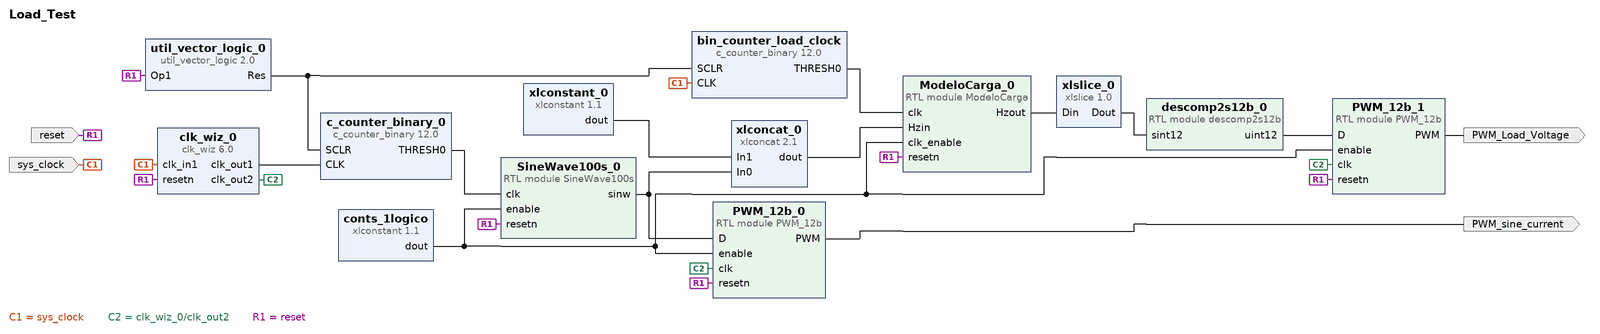
[diagram p0: block diagram of the top level]
# Vivado block design Load_Test, xc7a35ticsg324-1L, Vivado 2018.2
create_bd_design Load_Test

create_bd_port -dir I -type clk sys_clock
set_property -dict {CONFIG.FREQ_HZ 100000000 CONFIG.PHASE 0.000} [get_bd_ports sys_clock]
create_bd_port -dir O PWM_sine_current
create_bd_port -dir O PWM_Load_Voltage
create_bd_port -dir I -type rst reset
set_property -dict {CONFIG.POLARITY ACTIVE_LOW} [get_bd_ports reset]

create_bd_cell -type ip -vlnv xilinx.com:ip:clk_wiz:6.0 clk_wiz_0
set_property -dict [list \
  CONFIG.PRIMITIVE PLL \
  CONFIG.CLKOUT2_USED true \
  CONFIG.NUM_OUT_CLKS 2 \
  CONFIG.CLKOUT1_REQUESTED_OUT_FREQ 12 \
  CONFIG.CLKOUT2_REQUESTED_OUT_FREQ 430 \
  CONFIG.CLKOUT1_DRIVES BUFGCE \
  CONFIG.CLKOUT2_DRIVES BUFGCE \
  CONFIG.CLKOUT3_DRIVES BUFGCE \
  CONFIG.CLKOUT4_DRIVES BUFGCE \
  CONFIG.CLKOUT5_DRIVES BUFGCE \
  CONFIG.CLKOUT6_DRIVES BUFGCE \
  CONFIG.CLKOUT7_DRIVES BUFGCE \
  CONFIG.FEEDBACK_SOURCE FDBK_AUTO \
  CONFIG.USE_LOCKED true \
  CONFIG.RESET_PORT resetn \
  CONFIG.MMCM_DIVCLK_DIVIDE 1 \
  CONFIG.MMCM_CLKFBOUT_MULT_F 13 \
  CONFIG.MMCM_COMPENSATION ZHOLD \
  CONFIG.MMCM_CLKOUT0_DIVIDE_F 108 \
  CONFIG.MMCM_CLKOUT1_DIVIDE 3 \
  CONFIG.RESET_TYPE ACTIVE_LOW \
  CONFIG.USE_SAFE_CLOCK_STARTUP true \
  CONFIG.USE_BOARD_FLOW true \
  CONFIG.CLK_IN1_BOARD_INTERFACE sys_clock \
  CONFIG.RESET_BOARD_INTERFACE reset \
  CONFIG.CLKOUT1_JITTER 172.617 \
  CONFIG.CLKOUT1_PHASE_ERROR 82.897 \
  CONFIG.CLKOUT2_JITTER 84.092 \
  CONFIG.CLKOUT2_PHASE_ERROR 82.897 \
] [get_bd_cells clk_wiz_0]
create_bd_cell -type ip -vlnv xilinx.com:ip:c_counter_binary:12.0 c_counter_binary_0
set_property -dict [list \
  CONFIG.Output_Width 11 \
  CONFIG.Increment_Value 1 \
  CONFIG.Restrict_Count true \
  CONFIG.Final_Count_Value 7D0 \
  CONFIG.Sync_Threshold_Output true \
  CONFIG.Threshold_Value 7D0 \
  CONFIG.SCLR true \
] [get_bd_cells c_counter_binary_0]
create_bd_cell -type ip -vlnv xilinx.com:ip:xlconcat:2.1 xlconcat_0
set_property -dict {CONFIG.IN0_WIDTH 12 CONFIG.IN1_WIDTH 4} [get_bd_cells xlconcat_0]
create_bd_cell -type ip -vlnv xilinx.com:ip:xlconstant:1.1 xlconstant_0
set_property -dict {CONFIG.CONST_WIDTH 4 CONFIG.CONST_VAL 0} [get_bd_cells xlconstant_0]
create_bd_cell -type module -reference descomp2s12b descomp2s12b_0
create_bd_cell -type ip -vlnv xilinx.com:ip:xlslice:1.0 xlslice_0
set_property -dict {CONFIG.DIN_TO 0 CONFIG.DIN_FROM 11 CONFIG.DIN_WIDTH 16 CONFIG.DOUT_WIDTH 12} [get_bd_cells xlslice_0]
create_bd_cell -type ip -vlnv xilinx.com:ip:xlconstant:1.1 conts_1logico
create_bd_cell -type ip -vlnv xilinx.com:ip:c_counter_binary:12.0 bin_counter_load_clock
set_property -dict [list \
  CONFIG.Output_Width 14 \
  CONFIG.Increment_Value 1 \
  CONFIG.Restrict_Count true \
  CONFIG.Final_Count_Value 2710 \
  CONFIG.Sync_Threshold_Output true \
  CONFIG.Threshold_Value 2710 \
  CONFIG.SCLR true \
] [get_bd_cells bin_counter_load_clock]
create_bd_cell -type module -reference ModeloCarga ModeloCarga_0
create_bd_cell -type ip -vlnv xilinx.com:ip:util_vector_logic:2.0 util_vector_logic_0
set_property -dict {CONFIG.C_SIZE 1 CONFIG.C_OPERATION not} [get_bd_cells util_vector_logic_0]
create_bd_cell -type module -reference PWM_12b PWM_12b_0
create_bd_cell -type module -reference PWM_12b PWM_12b_1
create_bd_cell -type module -reference SineWave100s SineWave100s_0

# ---- connections ----

connect_bd_net [get_bd_ports sys_clock] [get_bd_pins clk_wiz_0/clk_in1] [get_bd_pins bin_counter_load_clock/CLK]
connect_bd_net [get_bd_pins clk_wiz_0/clk_out1] [get_bd_pins c_counter_binary_0/CLK]
connect_bd_net [get_bd_pins c_counter_binary_0/THRESH0] [get_bd_pins SineWave100s_0/clk]
connect_bd_net [get_bd_pins SineWave100s_0/sinw] [get_bd_pins PWM_12b_0/D] [get_bd_pins xlconcat_0/In0]
connect_bd_net [get_bd_pins xlconstant_0/dout] [get_bd_pins xlconcat_0/In1]
connect_bd_net [get_bd_pins descomp2s12b_0/uint12] [get_bd_pins PWM_12b_1/D]
connect_bd_net [get_bd_pins xlslice_0/Dout] [get_bd_pins descomp2s12b_0/sint12]
connect_bd_net [get_bd_pins clk_wiz_0/clk_out2] [get_bd_pins PWM_12b_0/clk] [get_bd_pins PWM_12b_1/clk]
connect_bd_net -net xlconstant_1_dout [get_bd_pins conts_1logico/dout] \
  [get_bd_pins ModeloCarga_0/clk_enable] [get_bd_pins PWM_12b_0/enable] [get_bd_pins PWM_12b_1/enable] \
  [get_bd_pins SineWave100s_0/enable]
connect_bd_net [get_bd_pins PWM_12b_0/PWM] [get_bd_ports PWM_sine_current]
connect_bd_net [get_bd_pins PWM_12b_1/PWM] [get_bd_ports PWM_Load_Voltage]
connect_bd_net [get_bd_pins bin_counter_load_clock/THRESH0] [get_bd_pins ModeloCarga_0/clk]
connect_bd_net [get_bd_pins ModeloCarga_0/Hzout] [get_bd_pins xlslice_0/Din]
connect_bd_net [get_bd_pins xlconcat_0/dout] [get_bd_pins ModeloCarga_0/Hzin]
connect_bd_net [get_bd_pins util_vector_logic_0/Res] [get_bd_pins c_counter_binary_0/SCLR] [get_bd_pins bin_counter_load_clock/SCLR]
connect_bd_net [get_bd_ports reset] \
  [get_bd_pins util_vector_logic_0/Op1] [get_bd_pins clk_wiz_0/resetn] [get_bd_pins ModeloCarga_0/resetn] \
  [get_bd_pins PWM_12b_0/resetn] [get_bd_pins PWM_12b_1/resetn] [get_bd_pins SineWave100s_0/resetn]

validate_bd_design
save_bd_design
